# EAGLE design sensors (EAGLE 6.1)
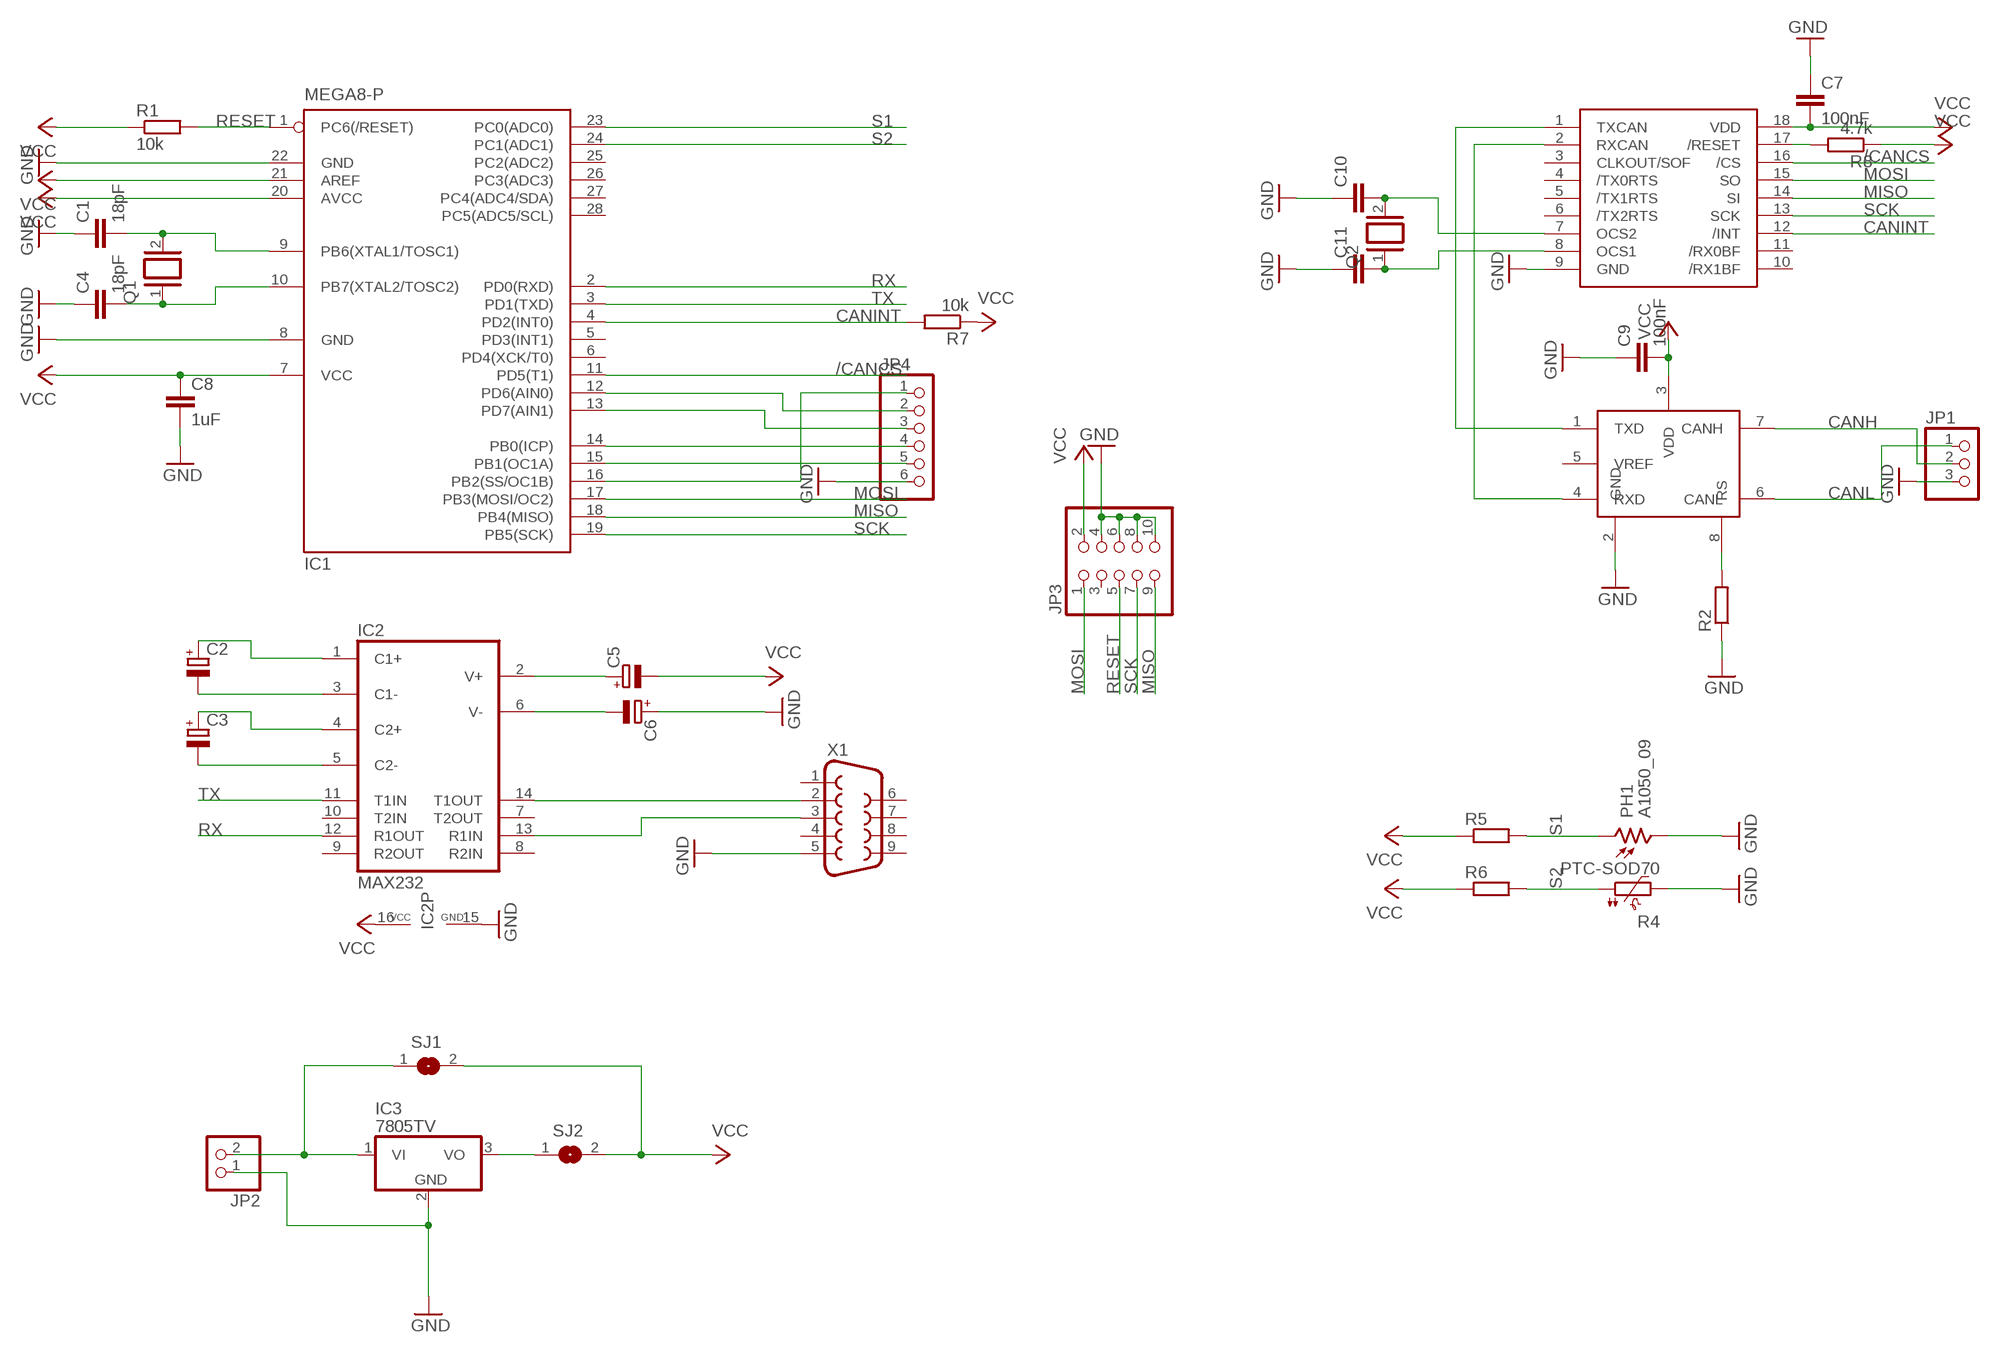
[diagram p0: schematic, sheet 1]

## Parts
C1  18pF  C-EU025-024X044  [C025-024X044]
C2  CPOL-EUE3.5-8  [E3,5-8]
C3  CPOL-EUE3.5-8  [E3,5-8]
C4  18pF  C-EU025-024X044  [C025-024X044]
C5  CPOL-EUE3.5-8  [E3,5-8]
C6  CPOL-EUE3.5-8  [E3,5-8]
C7  100nF  C-EUC0603  [C0603]
C8  1uF  C-EUC0603  [C0603]
C9  100nF  C-EUC0603  [C0603]
C10  C-EUC0603  [C0603]
C11  C-EUC0603  [C0603]
IC1  MEGA8-P  [DIL28-3]
IC2  MAX232  [DIL16]
IC3  7805TV  [TO220V]
JP1  PINHD-1X3  [1X03]
JP2  PINHD-1X2  [1X02]
JP3  PINHD-2X5  [2X05]
JP4  PINHD-1X6  [1X06]
PH1  A1050_09  [T0-46-A10XX]
Q1  XTAL/S  [QS]
Q2  XTAL/S  [QS]
R1  10k  R-EU_0207/10  [0207/10]
R2  R-EU_0207/10  [0207/10]
R4  PTC-SOD70  [SOD70]
R5  R-EU_0207/10  [0207/10]
R6  R-EU_0207/10  [0207/10]
R7  10k  R-EU_0207/10  [0207/10]
R8  4.7k  R-EU_0207/10  [0207/10]
SJ1  SJ  [SJ]
SJ2  SJ  [SJ]
U$1  MCP251518-LEAD_SOIC  [SOIC18L]
U$2  MCP2551DIL8  [DIL8]
X1  F09HP  [F09HP]

## Nets
/CANCS: IC1.11(PD5(T1)) U$1.16(/CS)
CANH: JP1.2 U$2.7(CANH)
CANINT: IC1.4(PD2(INT0)) R7.2 U$1.12(/INT)
CANL: JP1.1 U$2.6(CANL)
GND: C1.1 C4.1 C6.+ C7.1 C8.2 C9.1 C10.1 C11.1 IC1.8(GND) IC1.22(GND) IC2.15(GND) IC3.2(GND) JP1.3 JP2.1 JP3.4 JP3.6 JP3.8 JP3.10 JP4.6 PH1.2 R2.1 R4.2 U$1.9(GND) U$2.2(GND) X1.5
MISO: IC1.18(PB4(MISO)) JP3.9 U$1.14(SI)
MOSI: IC1.17(PB3(MOSI/OC2)) JP3.1 U$1.15(SO)
N$1: U$1.1(TXCAN) U$2.1(TXD)
N$2: U$1.2(RXCAN) U$2.4(RXD)
N$3: C3.+ IC2.4(C2+)
N$4: C2.- IC2.3(C1-)
N$5: C2.+ IC2.1(C1+)
N$6: C3.- IC2.5(C2-)
N$7: C1.2 IC1.9(PB6(XTAL1/TOSC1)) Q1.2
N$8: C4.2 IC1.10(PB7(XTAL2/TOSC2)) Q1.1
N$9: R2.2 U$2.8(RS)
N$10: IC2.14(T1OUT) X1.2
N$11: IC2.13(R1IN) X1.3
N$12: C5.+ IC2.2(V+)
N$13: C6.- IC2.6(V-)
N$14: IC1.14(PB0(ICP)) JP4.4
N$15: IC3.3(VO) SJ2.1
N$16: IC3.1(VI) JP2.2 SJ1.1
N$17: IC1.15(PB1(OC1A)) JP4.5
N$18: IC1.16(PB2(SS/OC1B)) JP4.1
N$19: IC1.12(PD6(AIN0)) JP4.2
N$20: IC1.13(PD7(AIN1)) JP4.3
N$21: R8.2 U$1.17(/RESET)
N$23: C10.2 Q2.2 U$1.7(OCS2)
N$31: C11.2 Q2.1 U$1.8(OCS1)
RESET: IC1.1(PC6(/RESET)) JP3.5 R1.2
RX: IC1.2(PD0(RXD)) IC2.12(R1OUT)
S1: IC1.23(PC0(ADC0)) PH1.1 R5.2
S2: IC1.24(PC1(ADC1)) R4.1 R6.2
SCK: IC1.19(PB5(SCK)) JP3.7 U$1.13(SCK)
TX: IC1.3(PD1(TXD)) IC2.11(T1IN)
VCC: C5.- C7.2 C8.1 C9.2 IC1.7(VCC) IC1.20(AVCC) IC1.21(AREF) IC2.16(VCC) JP3.2 R1.1 R5.1 R6.1 R7.1 R8.1 SJ1.2 SJ2.2 U$1.18(VDD) U$2.3(VDD)
Unconnected: IC1.5(PD3(INT1)) IC1.6(PD4(XCK/T0)) IC1.25(PC2(ADC2)) IC1.26(PC3(ADC3)) IC1.27(PC4(ADC4/SDA)) IC1.28(PC5(ADC5/SCL)) IC2.7(T2OUT) IC2.8(R2IN) IC2.9(R2OUT) IC2.10(T2IN) JP3.3 U$1.3(CLKOUT/SOF) U$1.4(/TX0RTS) U$1.5(/TX1RTS) U$1.6(/TX2RTS) U$1.10(/RX1BF) U$1.11(/RX0BF) U$2.5(VREF) X1.1 X1.4 X1.6 X1.7 X1.8 X1.9

## Library data of the parts
C1 C4 = resistor:C-EU: CAPACITOR, European symbol
C2 C3 C5 C6 = rcl:CPOL-EU: POLARIZED CAPACITOR, European symbol
C7-C11 = rcl:C-EU: CAPACITOR, European symbol
IC1 = atmel:MEGA8-P: MICROCONTROLLER 8 Kbytes FLASH, 1 kbytes SRAM, 512 bytes EEPROM, USART, 4-channel 10 bit ADC, 2-channel 8 bit ADC Pin compatible with Atmega48, ATMega88, ATMega168 Source: avr.lbr; OC_FARNELL: unknown; OC_NEWARK: unknown
IC2 = maxim:MAX232: RS232 TRANSEIVER; MF: MAXIM; MPN: MAX232ACPE+; OC_FARNELL: 9723773; OC_NEWARK: 68K4544
IC3 = linear:78*: Positive VOLTAGE REGULATOR Source: http://cache.national.com/ds/LM/LM78L05.pdf http://www.fairchildsemi.com/ds/LM/LM7805.pdf
JP1 = pinhead:PINHD-1X3: PIN HEADER
JP2 = pinhead:PINHD-1X2: PIN HEADER
JP3 = pinhead:PINHD-2X5: PIN HEADER
JP4 = pinhead:PINHD-1X6: PIN HEADER
PH1 = photo-elements:A10: Sensor Robust Light Sensing Applications Outdoor Light Sensing Application Source: http://optoelectronics.perkinelmer.com/content/Datasheets/DTS_PhotocellsA1050.pdf
Q1 Q2 = special:XTAL/S: CRYSTAL
R1 R2 R7 = resistor:R-EU_: RESISTOR, European symbol
R4 = ptc-ntc:PTC-: Positive Temperature Coefficient Resistor (PTC) termistor Philips KTY81-210 - KTY81-252 Source: 153627-da-01-en-Temperatur-Sensor_KTY10-6_Philips.pdf; OC_FARNELL: unknown; OC_NEWARK: unknown
R5 R6 R8 = rcl:R-EU_: RESISTOR, European symbol
SJ1 SJ2 = jumper:SJ: SMD solder JUMPER
U$1 = glados:MCP2515
U$2 = glados:MCP2551
X1 = con-subd:F09: SUB-D; OC_FARNELL: unknown; OC_NEWARK: unknown

## Board
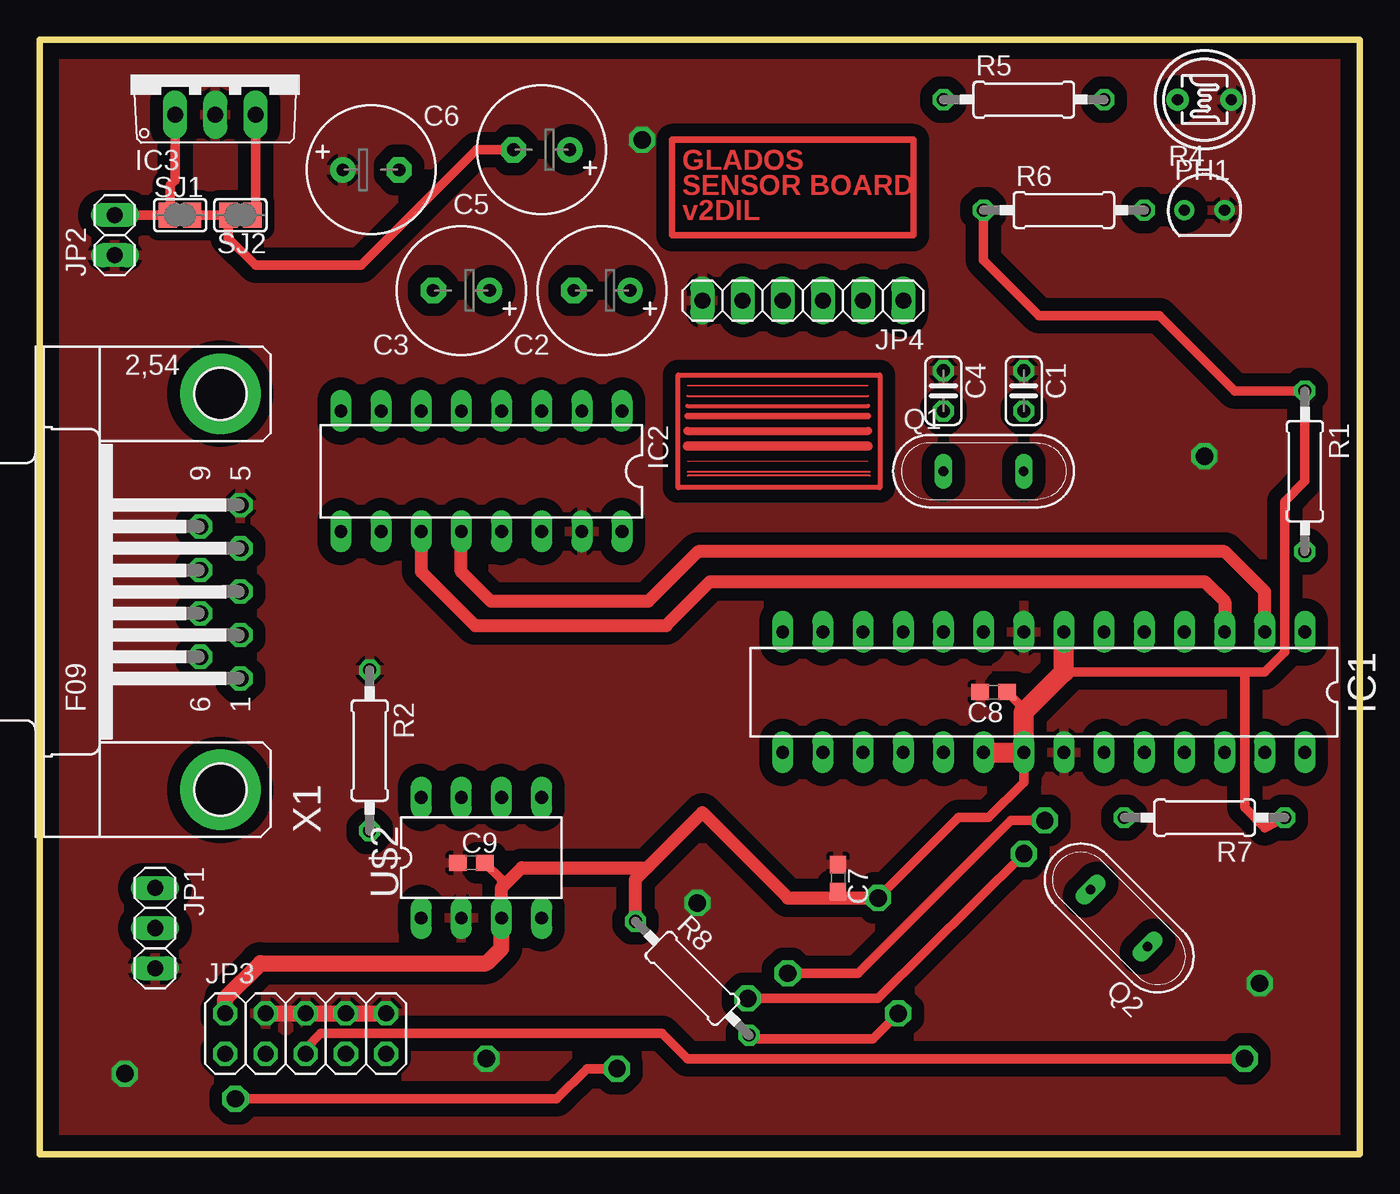
[diagram p1: board, top side]
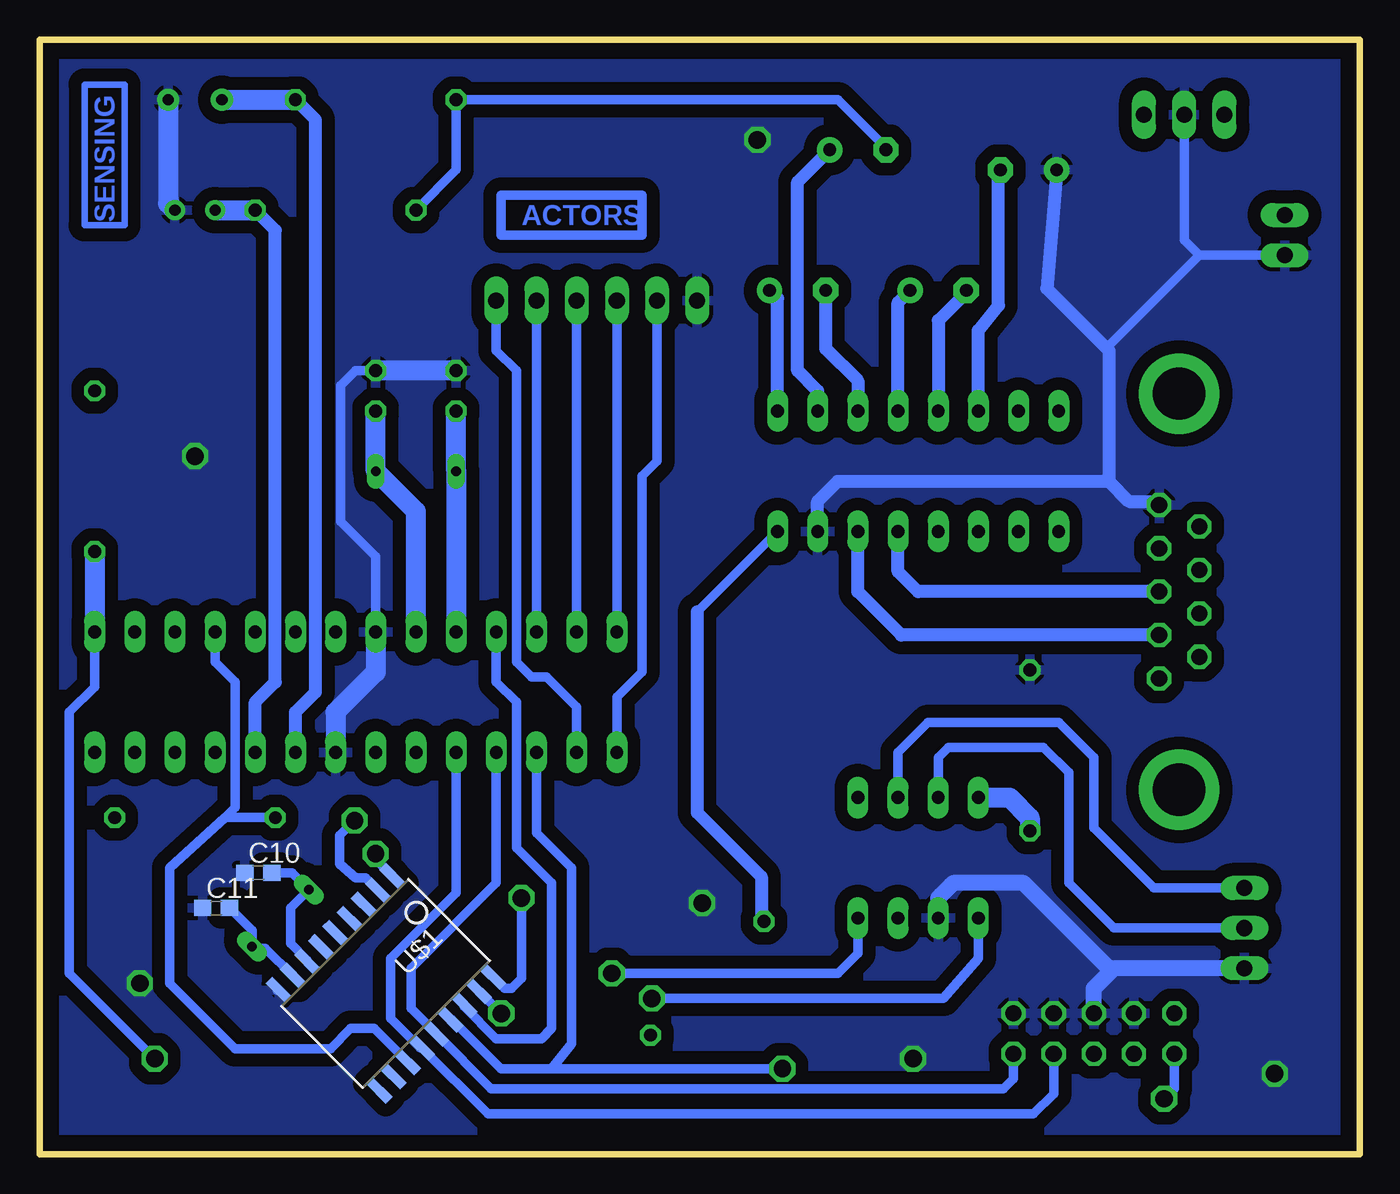
[diagram p2: board, bottom side, seen from below]

Size 83.49 x 70.47 mm. Coordinates in mm from the lower left corner, seen from the top.
Outline: 0,0 83.49,0 83.49,70.47 0,70.47 0,0
Copper layers (1*16): Top 0.035mm / dielectric 1.5mm / Bottom 0.035mm
Design rules: minimum track width 10mil, minimum drill 24mil, track to track 8mil, track to pad 8mil, pad to pad 8mil, via to via 8mil, smd to smd 8mil, copper to edge 40mil, drill to drill 8mil, minimum pad ring 10mil, minimum via ring 8mil, stop-mask expansion 4mil, vias tented up to drill 0mil, thermal gap 10mil

### Footprints (pad centres in the part's own frame; a part is rotated, then mirrored left to right if it is on the bottom)
C025-024X044 = drill 0.813 octagon: 1 -1.27,0; 2 1.27,0
E3,5-8 = drill 0.813 pad 1.6: + -1.778,0 | drill 0.813 pad 1.6 octagon: - 1.778,0
C0603 = smd 1.1 x 1: 1 -0.85,0; 2 0.85,0
DIL28-3 = drill 0.813 long: 1 -16.51,-3.81; 2 -13.97,-3.81; 3 -11.43,-3.81; 4 -8.89,-3.81; 5 -6.35,-3.81; 6 -3.81,-3.81; 7 -1.27,-3.81; 8 1.27,-3.81; 9 3.81,-3.81; 10 6.35,-3.81; 11 8.89,-3.81; 12 11.43,-3.81; 13 13.97,-3.81; 14 16.51,-3.81; 15 16.51,3.81; 16 13.97,3.81; 17 11.43,3.81; 18 8.89,3.81; 19 6.35,3.81; 20 3.81,3.81; 21 1.27,3.81; 22 -1.27,3.81; 23 -3.81,3.81; 24 -6.35,3.81; 25 -8.89,3.81; 26 -11.43,3.81; 27 -13.97,3.81; 28 -16.51,3.81
DIL16 = drill 0.813 long: 1 -8.89,-3.81; 2 -6.35,-3.81; 3 -3.81,-3.81; 4 -1.27,-3.81; 5 1.27,-3.81; 6 3.81,-3.81; 7 6.35,-3.81; 8 8.89,-3.81; 9 8.89,3.81; 10 6.35,3.81; 11 3.81,3.81; 12 1.27,3.81; 13 -1.27,3.81; 14 -3.81,3.81; 15 -6.35,3.81; 16 -8.89,3.81
TO220V = drill 1.016 long: 1 -2.54,-2.54; 2 0,-2.54; 3 2.54,-2.54
1X03 = drill 1.016 long: 1 -2.54,0; 2 0,0; 3 2.54,0
1X02 = drill 1.016 long: 1 -1.27,0; 2 1.27,0
2X05 = drill 1.016 octagon: 1 -5.08,-1.27; 2 -5.08,1.27; 3 -2.54,-1.27; 4 -2.54,1.27; 5 0,-1.27; 6 0,1.27; 7 2.54,-1.27; 8 2.54,1.27; 9 5.08,-1.27; 10 5.08,1.27
1X06 = drill 1.016 long: 1 -6.35,0; 2 -3.81,0; 3 -1.27,0; 4 1.27,0; 5 3.81,0; 6 6.35,0
T0-46-A10XX = drill 0.7 pad 1.4: 1 -1.7,0; 2 1.7,0
QS = drill 0.61 long: 1 -2.54,0; 2 2.54,0
0207/10 = drill 0.813 octagon: 1 -5.08,0; 2 5.08,0
SOD70 = drill 0.7 pad 1.27: 1 -1.27,0; 2 1.27,0
SJ = smd 1.168 x 1.6: 1 -0.762,0; 2 0.762,0
SOIC18L = smd 0.6 x 1.8: 1 -5.08,-4.475; 2 -3.81,-4.475; 3 -2.54,-4.475; 4 -1.27,-4.475; 5 0,-4.475; 6 1.27,-4.475; 7 2.54,-4.475; 8 3.81,-4.475; 9 5.08,-4.475; 10 5.08,4.475; 11 3.81,4.475; 12 2.54,4.475; 13 1.27,4.475; 14 0,4.475; 15 -1.27,4.475; 16 -2.54,4.475; 17 -3.81,4.475; 18 -5.08,4.475
DIL8 = drill 0.813 long: 1 -3.81,-3.81; 2 -1.27,-3.81; 3 1.27,-3.81; 4 3.81,-3.81; 5 3.81,3.81; 6 1.27,3.81; 7 -1.27,3.81; 8 -3.81,3.81
F09HP = drill 1.016 octagon: 1 -5.486,-1.27; 2 -2.743,-1.27; 3 0,-1.27; 4 2.743,-1.27; 5 5.486,-1.27; 6 -4.115,1.27; 7 -1.372,1.27; 8 1.372,1.27; 9 4.115,1.27 | drill 3.302 pad 5.08: G1 -12.522,0; G2 12.522,0

### Placement (x,y rotation side)
C1  62.23,48.26 270 top
C2  35.56,54.61 180 top
C3  26.67,54.61 180 top
C4  57.15,48.26 270 top
C5  31.75,63.5 180 top
C6  20.95,62.23 0 top
C7  50.48,17.46 270 top
C8  60.33,29.21 180 top
C9  27.3,18.41 0 top
C10  69.66,17.78 0 bottom
C11  72.32,15.56 0 bottom
IC1  63.5,29.21 180 top
IC2  27.94,43.18 180 top
IC3  11.11,68.26 0 top
JP1  7.3,14.29 270 top
JP2  4.76,58.1 90 top
JP3  16.83,7.62 0 top
JP4  48.26,53.98 180 top
PH1  73.66,66.67 0 top
Q1  59.69,43.18 0 top
Q2  68.26,14.92 135 top
R1  80.01,43.18 270 top
R2  20.88,25.52 270 top
R4  73.66,59.69 0 top
R5  62.23,66.67 0 top
R6  64.77,59.69 0 top
R7  73.66,21.27 180 top
R8  41.27,11.11 315 top
SJ1  8.89,59.37 0 top
SJ2  12.7,59.37 180 top
U$1  61.59,10.79 225 bottom
U$2  27.94,18.73 0 top
X1  11.43,35.56 90 top

### Tracks (layer width: path | path; a pad name or v marks a point on that pad's centre or on a via)
/CANCS
  Bottom 0.61: U$1.16 56.63,9.33 54.61,7.3 51.75,7.3 51.12,7.94 51.12,17.14 53.34,19.37 53.34,28.59 54.61,29.86 IC1.11
CANH
  Bottom 0.61: U$2.7 26.67,25.08 26.04,25.72 20,25.72 18.41,24.13 18.41,17.14 15.56,14.29 JP1.2
CANINT
  Bottom 0.61: IC1.4 72.39,31.11 71.12,29.84 71.12,21.91 71.75,21.27 | U$1.12 62.33,7.94 63.82,7.94 65.09,6.67 71.12,6.67 75.25,10.79 75.25,18.1 71.75,21.27 | R7.2 71.75,21.27
CANL
  Bottom 0.61: JP1.1 13.02,16.83 16.83,20.64 16.83,25.08 19.05,27.3 27.3,27.3 29.21,25.4 U$2.6
GND  (via drill 1.1)
  Top 1.016: JP3.4 JP3.6 JP3.8 JP3.10
  Bottom 0.61: U$1.9 68.47,10.37 | 64.77,24.45 IC1.22 | IC1.8 62.23,37.78 64.45,40.01 64.45,48.58 63.5,49.53 C1.1 | 26.04,17.14 26.67,16.51 26.67,16.19 U$2.2 | IC3.2 11.11,57.79 10.16,56.83 | 10.16,56.83 JP2.1 | 15.88,50.8 15.88,51.12 10.16,56.83
  Bottom 0.813: C6.+ 19.81,54.74 15.88,50.8 15.88,42.55 | 15.88,42.55 14.61,41.28 12.93,41.28 X1.5 | 15.88,42.55 33.02,42.55 34.29,41.28 IC2.15
  Bottom 1.016: JP3.6 16.83,10.48 15.56,11.75 | JP1.3 15.56,11.75 | 15.56,11.75 15.88,11.75 21.27,17.14 25.72,17.14 26.67,16.19
  Bottom 1.27: C4.1 C1.1 | PH1.2 75.36,60.12 R4.2 | IC1.8 62.23,30.48 64.77,27.94 IC1.22
  other vias: 73.66,44.13 77.15,10.79 28.26,6.03 38.1,64.14 5.4,5.08 41.59,15.88
  pour Bottom (isolate 0.813): -11.43,76.52 103.5,76.52 103.5,-12.07 -11.43,-12.07
  pour Top (isolate 0.813): -26.99,82.55 114.62,82.55 114.62,-2.54 -26.67,-2.54
MISO
  Bottom 0.61: U$1.14 | U$1.14 60.01,9.21 60.01,11.75 54.61,17.14 IC1.18 | JP3.9 21.91,4.76 22.54,4.13 54.93,4.13 U$1.14
MOSI  (via drill 1.1)
  Top 0.61: v36.51,5.4 34.61,5.4 32.7,3.49 v12.38,3.49
  Bottom 0.61: U$1.15 57.42,8.53 54.29,5.4 51.12,5.4 | 51.12,5.4 49.85,6.98 49.85,18.1 52.07,20.32 IC1.17 | JP3.1 11.75,4.13 v12.38,3.49 | v36.51,5.4 51.12,5.4
N$1  (via drill 1.1)
  Top 0.61: v44.77,9.84 53.02,9.84 v62.24,18.99
  Bottom 0.61: U$2.1 24.13,12.38 26.35,9.84 v44.77,9.84 | v62.24,18.99 62.11,18.49 U$1.1
N$2  (via drill 1.1)
  Top 0.61: v47.31,11.43 51.75,11.43 61.41,21.09 v63.57,21.09
  Bottom 0.61: U$2.4 31.75,12.7 33.02,11.43 v47.31,11.43 | v63.57,21.09 64.52,20.14 64.52,18.36 63.5,17.46 62.87,17.46 U$1.2
N$3
  Bottom 0.813: IC2.4 29.21,53.85 C3.+
N$4
  Bottom 0.813: C2.- 33.78,50.93 31.75,48.9 IC2.3
N$5
  Bottom 0.813: IC2.1 36.83,54.1 C2.+
N$6
  Bottom 0.813: C3.- 24.89,54.48 26.67,52.71 IC2.5
N$7
  Bottom 1.27: IC1.9 59.69,40.64 Q1.2 C1.2
N$8
  Bottom 1.27: IC1.10 Q1.1 C4.2
N$9
  Bottom 1.27: U$2.8 22.15,22.54 20.88,21.27 R2.2
N$10
  Bottom 0.813: X1.2 29.01,32.82 31.75,35.56 IC2.14
N$11
  Bottom 0.813: X1.3 27.94,35.56 29.21,36.83 IC2.13
N$12
  Bottom 0.813: IC2.2 34.29,48.26 35.56,49.53 35.56,61.47 C5.+
N$13
  Bottom 0.813: IC2.6 24.13,52.07 22.86,53.66 22.86,62.1 C6.-
N$14
  Bottom 0.61: IC1.14 JP4.4
N$15
  Top 0.61: IC3.3 13.65,59.56 SJ2.1
N$16
  Top 0.61: IC3.1 8.57,61.6 8.26,61.28 8.26,59.5 SJ1.1 JP2.2
N$17
  Bottom 0.61: IC1.15 46.99,28.89 45.4,30.48 45.4,42.86 44.45,43.82 JP4.5
N$18
  Bottom 0.61: IC1.16 49.53,28.26 51.44,30.16 52.39,30.16 53.34,31.11 53.34,49.53 54.61,50.8 JP4.1
N$19
  Bottom 0.61: IC1.12 JP4.2
N$20
  Bottom 0.61: IC1.13 JP4.3
N$21  (via drill 1.1)
  Top 0.61: v54.29,8.89 52.7,7.3 45.09,7.3 R8.2
  Bottom 0.61: U$1.17 55.73,10.32 v54.29,8.89
N$22
  Bottom 0.406: 78.11,67.63 80.64,67.63 80.64,58.74 78.11,58.74 78.11,67.63
N$23
  Bottom 0.61: U$1.7 66.56,12.26 67.63,13.33 67.63,15.56 Q2.2 67.53,17.78 C10.2
N$24
  Top 0.125: 40.96,47.94 52.39,47.94
N$25
  Top 0.25: 40.96,47.31 52.39,47.31
N$26
  Top 0.1: 40.96,48.58 52.39,48.58
N$27
  Top 0.4: 40.96,46.67 52.39,46.67
N$28
  Top 0.5: 40.96,45.72 52.39,45.72
N$29
  Top 0.6: 40.96,44.77 52.39,44.77
N$30
  Top 0.05: 40.96,43.82 52.39,43.82
N$31
  Bottom 0.61: U$1.8 67.46,11.26 69.22,13.02 69.95,13.02 Q2.1 70.06,14.14 C11.2
N$32
  Top 0.125: 41,43.15 52.5,43.15
N$33
  Top 0.125: 52.5,42.9 41,42.9
N$34
  Top 0.305: 40.38,49.27 53.12,49.27 53.12,42.15 40.38,42.15 40.38,49.27
RAHMEN1
  Top 0.406: 40.01,58.1 55.24,58.1 55.24,64.14 40.01,64.14 40.01,58.1
RAHMEN2
  Bottom 0.61: 45.4,60.64 54.29,60.64 54.29,58.1 45.4,58.1 45.4,60.64
RESET  (via drill 1.1)
  Top 0.61: JP3.5 16.83,6.67 17.78,7.62 39.37,7.62 40.96,6.03 v76.2,6.03
  Bottom 0.61: IC1.1 80.01,29.53 81.6,27.94 81.6,11.43 v76.2,6.03
  Bottom 1.27: R1.2 IC1.1
RX
  Top 0.813: IC1.2 77.47,35.56 74.93,38.1 41.64,38.1 38.48,34.95 28.55,34.95 26.67,36.83 IC2.12
S1
  Bottom 0.813: IC1.23 67.31,27.94 66.04,29.21 66.04,65.41 R5.2
  Bottom 1.27: PH1.1 R5.2
S2
  Bottom 0.813: IC1.24 69.85,28.57 68.58,29.84 68.58,58.42 R6.2
  Bottom 1.27: R4.1 R6.2
SCK
  Bottom 0.61: IC1.19 56.83,25.08 56.83,24.77 57.15,24.45 57.15,16.51 61.28,12.38 61.28,8.57 59.44,6.73 U$1.13 55.14,2.54 20.64,2.54 19.37,3.81 JP3.7
TX
  Top 0.813: IC2.11 24.13,36.83 27.55,33.42 39.62,33.42 42.4,36.2 73.66,36.2 74.93,34.93 IC1.3
VCC  (via drill 1.1)
  Top 0.61: IC1.21 62.23,23.5 60.01,21.27 58.1,21.27 v53.02,16.19 | SJ1.2 SJ2.2 11.94,57.91 13.65,56.2 20.32,56.2 27.62,63.5 C5.- | R6.1 59.69,56.52 63.18,53.02 70.8,53.02 75.56,48.26 R1.1 80.01,42.55 78.74,41.28 78.74,31.75 77.47,30.48 76.2,30.48 | 76.2,30.48 64.77,30.48 | 76.2,30.48 76.2,21.91 77.47,20.64 R7.1 | C7.2 50.48,16.19 | 62.23,27.94 62.23,28.16 C8.1 | 29.21,16.83 29.21,17.36 C9.2
  Top 0.813: U$2.3 29.21,15.56 29.21,16.83 30.48,18.1 38.42,18.1 | 38.42,18.1 41.91,21.59 47.31,16.19 50.48,16.19 v53.02,16.19 | R8.1 37.68,17.36 38.42,18.1
  Top 1.016: JP3.2 11.75,9.84 13.97,12.06 28.26,12.06 29.21,13.02 29.21,15.56
  Top 1.27: IC1.7 64.77,30.48 62.23,27.94 IC1.21 IC1.20
  Bottom 0.61: v53.02,16.19 53.02,11.11 53.66,10.48 54.09,10.48 U$1.18 | 41.91,34.29 IC2.16 | C5.- 29.97,63.63 33.02,66.67 R5.1 57.15,62.23 R6.1
  Bottom 0.813: 41.91,34.29 41.91,21.59 37.86,17.54 37.86,14.88 R8.1

### Text on the board
Top: GLADOS | SENSOR BOARD | v2DIL
Bottom: SENSING | ACTORS